# Altium project 基于DRV8813双电机驱动电路项目.PrjPCB
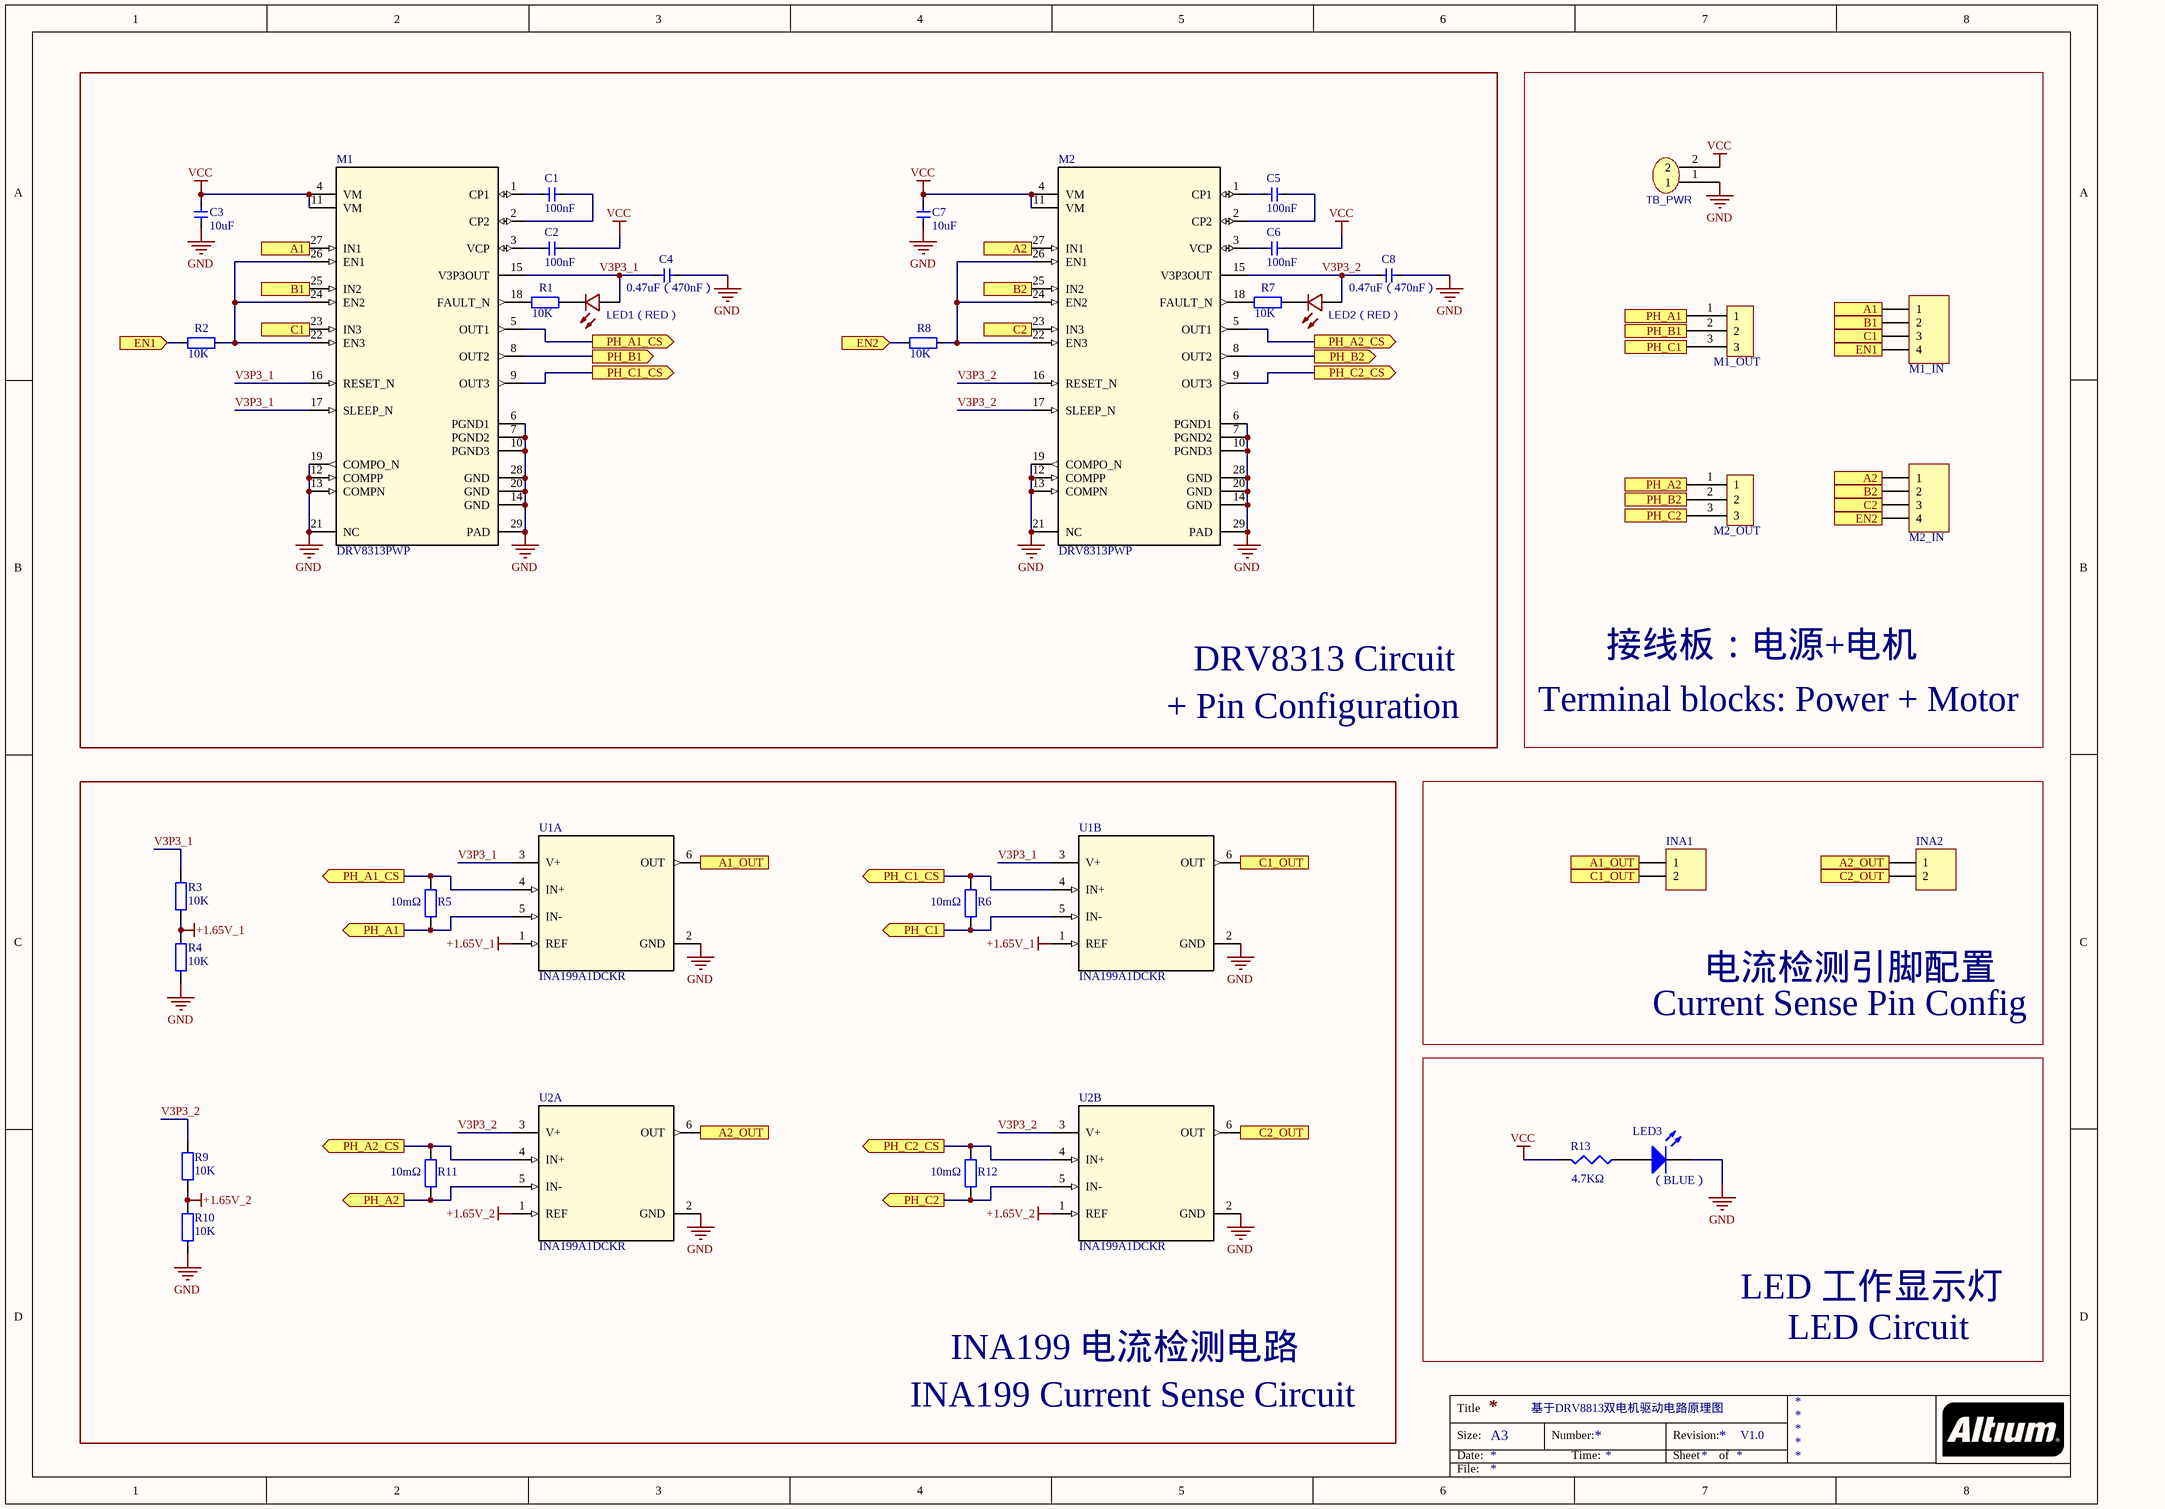
[diagram p0: 基于DRV8813双电机驱动电路原理图.SchDoc]
1 sheet, 37 parts. Net scope: flat (ports and power ports of the same name join across sheets).
Board file: 基于DRV8813双电机驱动电路.PcbDoc

## Sheet 基于DRV8813双电机驱动电路原理图.SchDoc
size A3

### Parts
C1  100nF  [0402 - CAP]
C2  100nF  [0402 - CAP]
C3  10uF  [0402 - CAP]
C4  0.47uF（470nF）  [0402 - CAP]
C5  100nF  [0402 - CAP]
C6  100nF  [0402 - CAP]
C7  10uF  [0402 - CAP]
C8  0.47uF（470nF）  [0402 - CAP]
INA1  *  [HDR1X2]  (value not drawn)
INA2  *  [HDR1X2]  (value not drawn)
LED1（RED）  19-213/Y2C-CQ2R2L/3T(CY)  [0603 - LED]  (value not drawn)
LED2（RED）  19-213/Y2C-CQ2R2L/3T(CY)  [0603 - LED]  (value not drawn)
LED3  （BLUE）  [0603 - LED]
M1  DRV8313PWP  [TTSOP-28-EP - duplicate]
M1_IN  MOTOR_IN_1  [HDR1X4]  (value not drawn)
M1_OUT  MOTOR-OUT-1  [HDR1X3]  (value not drawn)
M2  DRV8313PWP  [TTSOP-28-EP - duplicate]
M2_IN  MOTOR_IN_1  [HDR1X4]  (value not drawn)
M2_OUT  MOTOR-OUT-1  [HDR1X3]  (value not drawn)
R1  10K  [0402 - RES]
R2  10K  [0402 - RES]
R3  10K  [0402 - RES]
R4  10K  [0402 - RES]
R5  10mΩ  [0402 - RES]
R6  10mΩ  [0402 - RES]
R7  10K  [0402 - RES]
R8  10K  [0402 - RES]
R9  10K  [0402 - RES]
R10  10K  [0402 - RES]
R11  10mΩ  [0402 - RES]
R12  10mΩ  [0402 - RES]
R13  value 4.7KΩ  [0402 - RES]  (hidden comment: Res3)
TB_PWR  TB002-500-02BE  [TB002-500-02BE]  (value not drawn)
U1A  INA199A1DCKR  [INA199（SOT-SC70） - duplicate]
U1B  INA199A1DCKR  [INA199（SOT-SC70） - duplicate]
U2A  INA199A1DCKR  [INA199（SOT-SC70） - duplicate]
U2B  INA199A1DCKR  [INA199（SOT-SC70） - duplicate]

### Ports
A1 (in), A1 (out), A1_OUT (out), A2 (in), A2 (out), A2_OUT (out), B1 (in), B1 (out), B2 (in), B2 (out), C1 (in), C1 (out), C1_OUT (out), C2 (in), C2 (out), C2_OUT (out), EN1 (in), EN1 (out), EN2 (in), EN2 (out), PH_A1 (out), PH_A1_CS (out), PH_A2 (out), PH_A2_CS (out), PH_B1 (out), PH_B2 (out), PH_C1 (out), PH_C1_CS (out), PH_C2 (out), PH_C2_CS (out)

### Nets
+1.65V_1: R3.2 R4.1 U1A.1(REF) U1B.1(REF)
+1.65V_2: R9.2 R10.1 U2A.1(REF) U2B.1(REF)
GND: C3.1 C4.1 C7.1 C8.1 LED3.2(K) M1.6(PGND1) M1.7(PGND2) M1.10(PGND3) M1.12(COMPP) M1.13(COMPN) M1.14(GND) M1.19(COMPO_N) M1.20(GND) M1.21(NC) M1.28(GND) M1.29(PAD) M2.6(PGND1) M2.7(PGND2) M2.10(PGND3) M2.12(COMPP) M2.13(COMPN) M2.14(GND) M2.19(COMPO_N) M2.20(GND) M2.21(NC) M2.28(GND) M2.29(PAD) R4.2 R10.2 TB_PWR.1 U1A.2(GND) U1B.2(GND) U2A.2(GND) U2B.2(GND)
VCC: C2.2 C3.2 C6.2 C7.2 M1.4(VM) M1.11(VM) M2.4(VM) M2.11(VM) R13.2 TB_PWR.2
V3P3_1: C4.2 LED1（RED）.1(A) M1.15(V3P3OUT) M1.16(RESET_N) M1.17(SLEEP_N) R3.1 U1A.3(V+) U1B.3(V+)
V3P3_2: C8.2 LED2（RED）.1(A) M2.15(V3P3OUT) M2.16(RESET_N) M2.17(SLEEP_N) R9.1 U2A.3(V+) U2B.3(V+)
NetC1_1: C1.1 M1.1(CP1)
NetC1_2: C1.2 M1.2(CP2)
NetC2_1: C2.1 M1.3(VCP)
NetC5_1: C5.1 M2.1(CP1)
NetC5_2: C5.2 M2.2(CP2)
NetC6_1: C6.1 M2.3(VCP)
NetINA1_1: INA1.1 U1A.6(OUT) ; port A1_OUT
NetINA1_2: INA1.2 U1B.6(OUT) ; port C1_OUT
NetINA2_1: INA2.1 U2A.6(OUT) ; port A2_OUT
NetINA2_2: INA2.2 U2B.6(OUT) ; port C2_OUT
NetLED1（RED）_2: LED1（RED）.2(C) R1.2
NetLED2（RED）_2: LED2（RED）.2(C) R7.2
NetLED3_1: LED3.1(A) R13.1
NetM1_5: M1.5(OUT1) R5.1 U1A.4(IN+) ; port PH_A1_CS
NetM1_8: M1.8(OUT2) M1_OUT.2 ; port PH_B1
NetM1_9: M1.9(OUT3) R6.1 U1B.4(IN+) ; port PH_C1_CS
NetM1_18: M1.18(FAULT_N) R1.1
NetM1_22: M1.22(EN3) M1.24(EN2) M1.26(EN1) R2.2
NetM1_23: M1.23(IN3) M1_IN.3 ; port C1
NetM1_25: M1.25(IN2) M1_IN.2 ; port B1
NetM1_27: M1.27(IN1) M1_IN.1 ; port A1
NetM1_IN_4: M1_IN.4 R2.1 ; port EN1
NetM1_OUT_1: M1_OUT.1 R5.2 U1A.5(IN-) ; port PH_A1
NetM1_OUT_3: M1_OUT.3 R6.2 U1B.5(IN-) ; port PH_C1
NetM2_5: M2.5(OUT1) R11.1 U2A.4(IN+) ; port PH_A2_CS
NetM2_8: M2.8(OUT2) M2_OUT.2 ; port PH_B2
NetM2_9: M2.9(OUT3) R12.1 U2B.4(IN+) ; port PH_C2_CS
NetM2_18: M2.18(FAULT_N) R7.1
NetM2_22: M2.22(EN3) M2.24(EN2) M2.26(EN1) R8.2
NetM2_23: M2.23(IN3) M2_IN.3 ; port C2
NetM2_25: M2.25(IN2) M2_IN.2 ; port B2
NetM2_27: M2.27(IN1) M2_IN.1 ; port A2
NetM2_IN_4: M2_IN.4 R8.1 ; port EN2
NetM2_OUT_1: M2_OUT.1 R11.2 U2A.5(IN-) ; port PH_A2
NetM2_OUT_3: M2_OUT.3 R12.2 U2B.5(IN-) ; port PH_C2

### Notes on the sheet
- + Pin Configuration
- DRV8313 Circuit
- Terminal blocks: Power + Motor
- 接线板：电源+电机
- 电流检测引脚配置
- Current Sense Pin Config
- LED 工作显示灯
- INA199 电流检测电路
- LED Circuit
- INA199 Current Sense Circuit
- 基于DRV8813双电机驱动电路原理图
- V1.0
- Title
- Size:
- Date:
- A3
- Number:
- Time:
- Revision:
- Sheet
- of
- File:

### Library data of the parts
C1-C8 = 电容-0402: Capacitor; Value: 0.1u
INA1 INA2 = Header 2: Header, 2-Pin; LatestRevisionDate: 17-Jul-2002; LatestRevisionNote: Re-released for DXP Platform.; Publisher: Altium Limited
LED1（RED） LED2（RED） = 19-213/Y2C-CQ2R2L/3T(CY): BOM_Manufacturer: EVERLIGHT; BOM_Supplier: LCSC; BOM_Manufacturer Part: 19-213/Y2C-CQ2R2L/3T(CY); BOM_Supplier Part: C72038; BOM_JLCPCB Part Class: Basic Part; spicePre: L; spiceSymbolName: 19-213/Y2C-CQ2R2L/3T(CY)
LED3 = LED3: Typical BLUE SiC LED; Published: 8-Jun-2000; LatestRevisionDate: 17-Dec-2003; LatestRevisionNote: PCB Footprint replaced.; DatasheetVersion: 16-Apr-2002; PackageVersion: 16-Apr-2002; PackageReference: 3.5X2.8X1.9; Publisher: Altium Limited; PackageDescription: SM LED; 2 C-Bend Leads; Body 3.5 x 2.8 x 1.9 mm, inc leads (LxWxH typ)
M1 M2 = DRV8313
M1_IN M2_IN = Header 4: Header, 4-Pin; LatestRevisionDate: 17-Jul-2002; LatestRevisionNote: Re-released for DXP Platform.; Publisher: Altium Limited
M1_OUT M2_OUT = TB002-500-03BE: Supplier 1: Mouser; Supplier Part Number 1: 490-TB002-500-03BE
R1 R2 R7 R8 = 电阻-0402: Resistor; Value: 22R
R3-R6 R9-R12 = R: 贴片电阻; 淘宝ID: 小糖豆的小窝窝; BOM名称: 贴片电阻; 下单链接: https://item.taobao.com/item.htm?ft=t&id=613637044352
R13 = Res3: Resistor; Published: 8-Jun-2000; LatestRevisionDate: 29-May-2009; LatestRevisionNote: IPC-7351 Footprint Added.; PackageReference: J1-1210; Publisher: Altium Limited; PackageDescription: Chip Resistor
TB_PWR = TB002-500-02BE: Contributor: the.skuric; Supplier 1: Mouser; Supplier Part Number 1: 490-TB002-500-02BE; spicePre: T; spiceSymbolName: TB002-500-02BE
U1A U1B U2A U2B = INA199A1DCKR: Mfr_Name: Texas Instruments; TYPE: TYPE; RefDes: RefDes